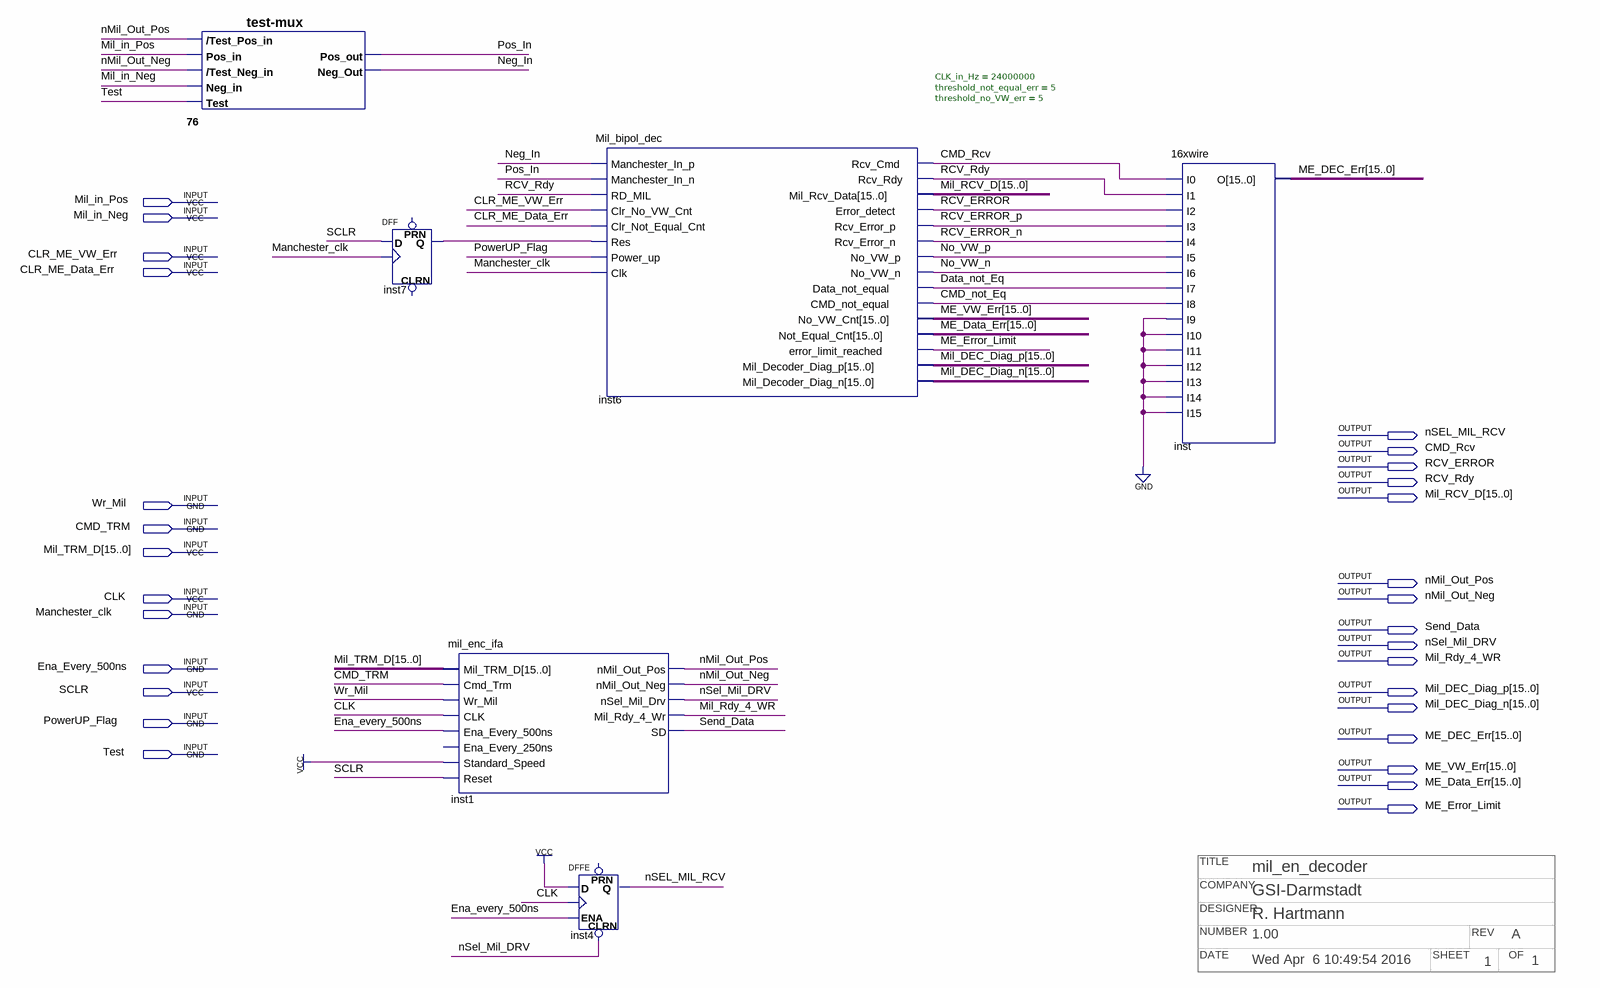
[diagram p0: schematic sheet]
// Quartus schematic mil_en_decoder_ifa.bdf as structural Verilog: 6 symbols, 29 pins
// Title block: TITLE: mil_en_decoder; COMPANY: GSI-Darmstadt; DESIGNER: R. Hartmann; NUMBER: 1.00; REV: A; DATE: Wed Apr  6 10:49:54 2016; SHEET: 1; OF: 1
module mil_en_decoder_ifa (
  input  Mil_in_Pos,
  input  Mil_in_Neg,
  input  CLR_ME_VW_Err,
  input  CLR_ME_Data_Err,
  input  Wr_Mil,
  input  CMD_TRM,
  input  [15:0] Mil_TRM_D,
  input  CLK,
  input  Manchester_clk,
  input  Ena_Every_500ns,
  input  SCLR,
  input  PowerUP_Flag,
  input  Test,
  output nSEL_MIL_RCV,
  output CMD_Rcv,
  output RCV_ERROR,
  output RCV_Rdy,
  output [15:0] Mil_RCV_D,
  output nMil_Out_Pos,
  output nMil_Out_Neg,
  output Send_Data,
  output nSel_Mil_DRV,
  output Mil_Rdy_4_WR,
  output [15:0] Mil_DEC_Diag_p,
  output [15:0] Mil_DEC_Diag_n,
  output [15:0] ME_DEC_Err,
  output [15:0] ME_VW_Err,
  output [15:0] ME_Data_Err,
  output ME_Error_Limit
);

  wire CMD_not_Eq, Data_not_Eq, inst7_q, Neg_In, No_VW_n, No_VW_p, Pos_In, RCV_ERROR_n, RCV_ERROR_p;

  \test-mux  u_76 (
    .\/Test_Pos_in (nMil_Out_Pos), .Pos_in(Mil_in_Pos), .\/Test_Neg_in (nMil_Out_Neg), .Neg_in(Mil_in_Neg),
    .Test(Test), .Pos_out(Pos_In), .Neg_Out(Neg_In));
  DFF inst7 (.CLK(Manchester_clk), .D(SCLR), .Q(inst7_q));  // open: CLRN, PRN
  mil_enc_ifa inst1 (
    .Mil_TRM_D(Mil_TRM_D), .Cmd_Trm(CMD_TRM), .Wr_Mil(Wr_Mil), .CLK(CLK), .Ena_Every_500ns(Ena_Every_500ns),
    .Standard_Speed(1'b1), .Reset(SCLR), .nMil_Out_Pos(nMil_Out_Pos), .nMil_Out_Neg(nMil_Out_Neg),
    .nSel_Mil_Drv(nSel_Mil_DRV), .Mil_Rdy_4_Wr(Mil_Rdy_4_WR), .SD(Send_Data));  // open: Ena_Every_250ns
  DFFE inst4 (.CLRN(nSel_Mil_DRV), .D(1'b1), .CLK(CLK), .ENA(Ena_Every_500ns), .Q(nSEL_MIL_RCV));  // open: PRN
  Mil_bipol_dec #(.CLK_in_Hz(24000000), .threshold_not_equal_err(5), .threshold_no_VW_err(5)) inst6 (
    .Manchester_In_p(Neg_In), .Manchester_In_n(Pos_In), .RD_MIL(RCV_Rdy), .Clr_No_VW_Cnt(CLR_ME_VW_Err),
    .Clr_Not_Equal_Cnt(CLR_ME_Data_Err), .Res(inst7_q), .Power_up(PowerUP_Flag), .Clk(Manchester_clk),
    .Rcv_Cmd(CMD_Rcv), .Rcv_Rdy(RCV_Rdy), .Mil_Rcv_Data(Mil_RCV_D), .Error_detect(RCV_ERROR),
    .Rcv_Error_p(RCV_ERROR_p), .Rcv_Error_n(RCV_ERROR_n), .No_VW_p(No_VW_p), .No_VW_n(No_VW_n),
    .Data_not_equal(Data_not_Eq), .CMD_not_equal(CMD_not_Eq), .No_VW_Cnt(ME_VW_Err),
    .Not_Equal_Cnt(ME_Data_Err), .error_limit_reached(ME_Error_Limit), .Mil_Decoder_Diag_p(Mil_DEC_Diag_p),
    .Mil_Decoder_Diag_n(Mil_DEC_Diag_n));
  \16xwire  inst (
    .I0(CMD_Rcv), .I1(RCV_Rdy), .I2(RCV_ERROR), .I3(RCV_ERROR_p), .I4(RCV_ERROR_n), .I5(No_VW_p),
    .I6(No_VW_n), .I7(Data_not_Eq), .I8(CMD_not_Eq), .I9(1'b0), .I10(1'b0), .I11(1'b0), .I12(1'b0),
    .I13(1'b0), .I14(1'b0), .I15(1'b0), .O(ME_DEC_Err));
endmodule
